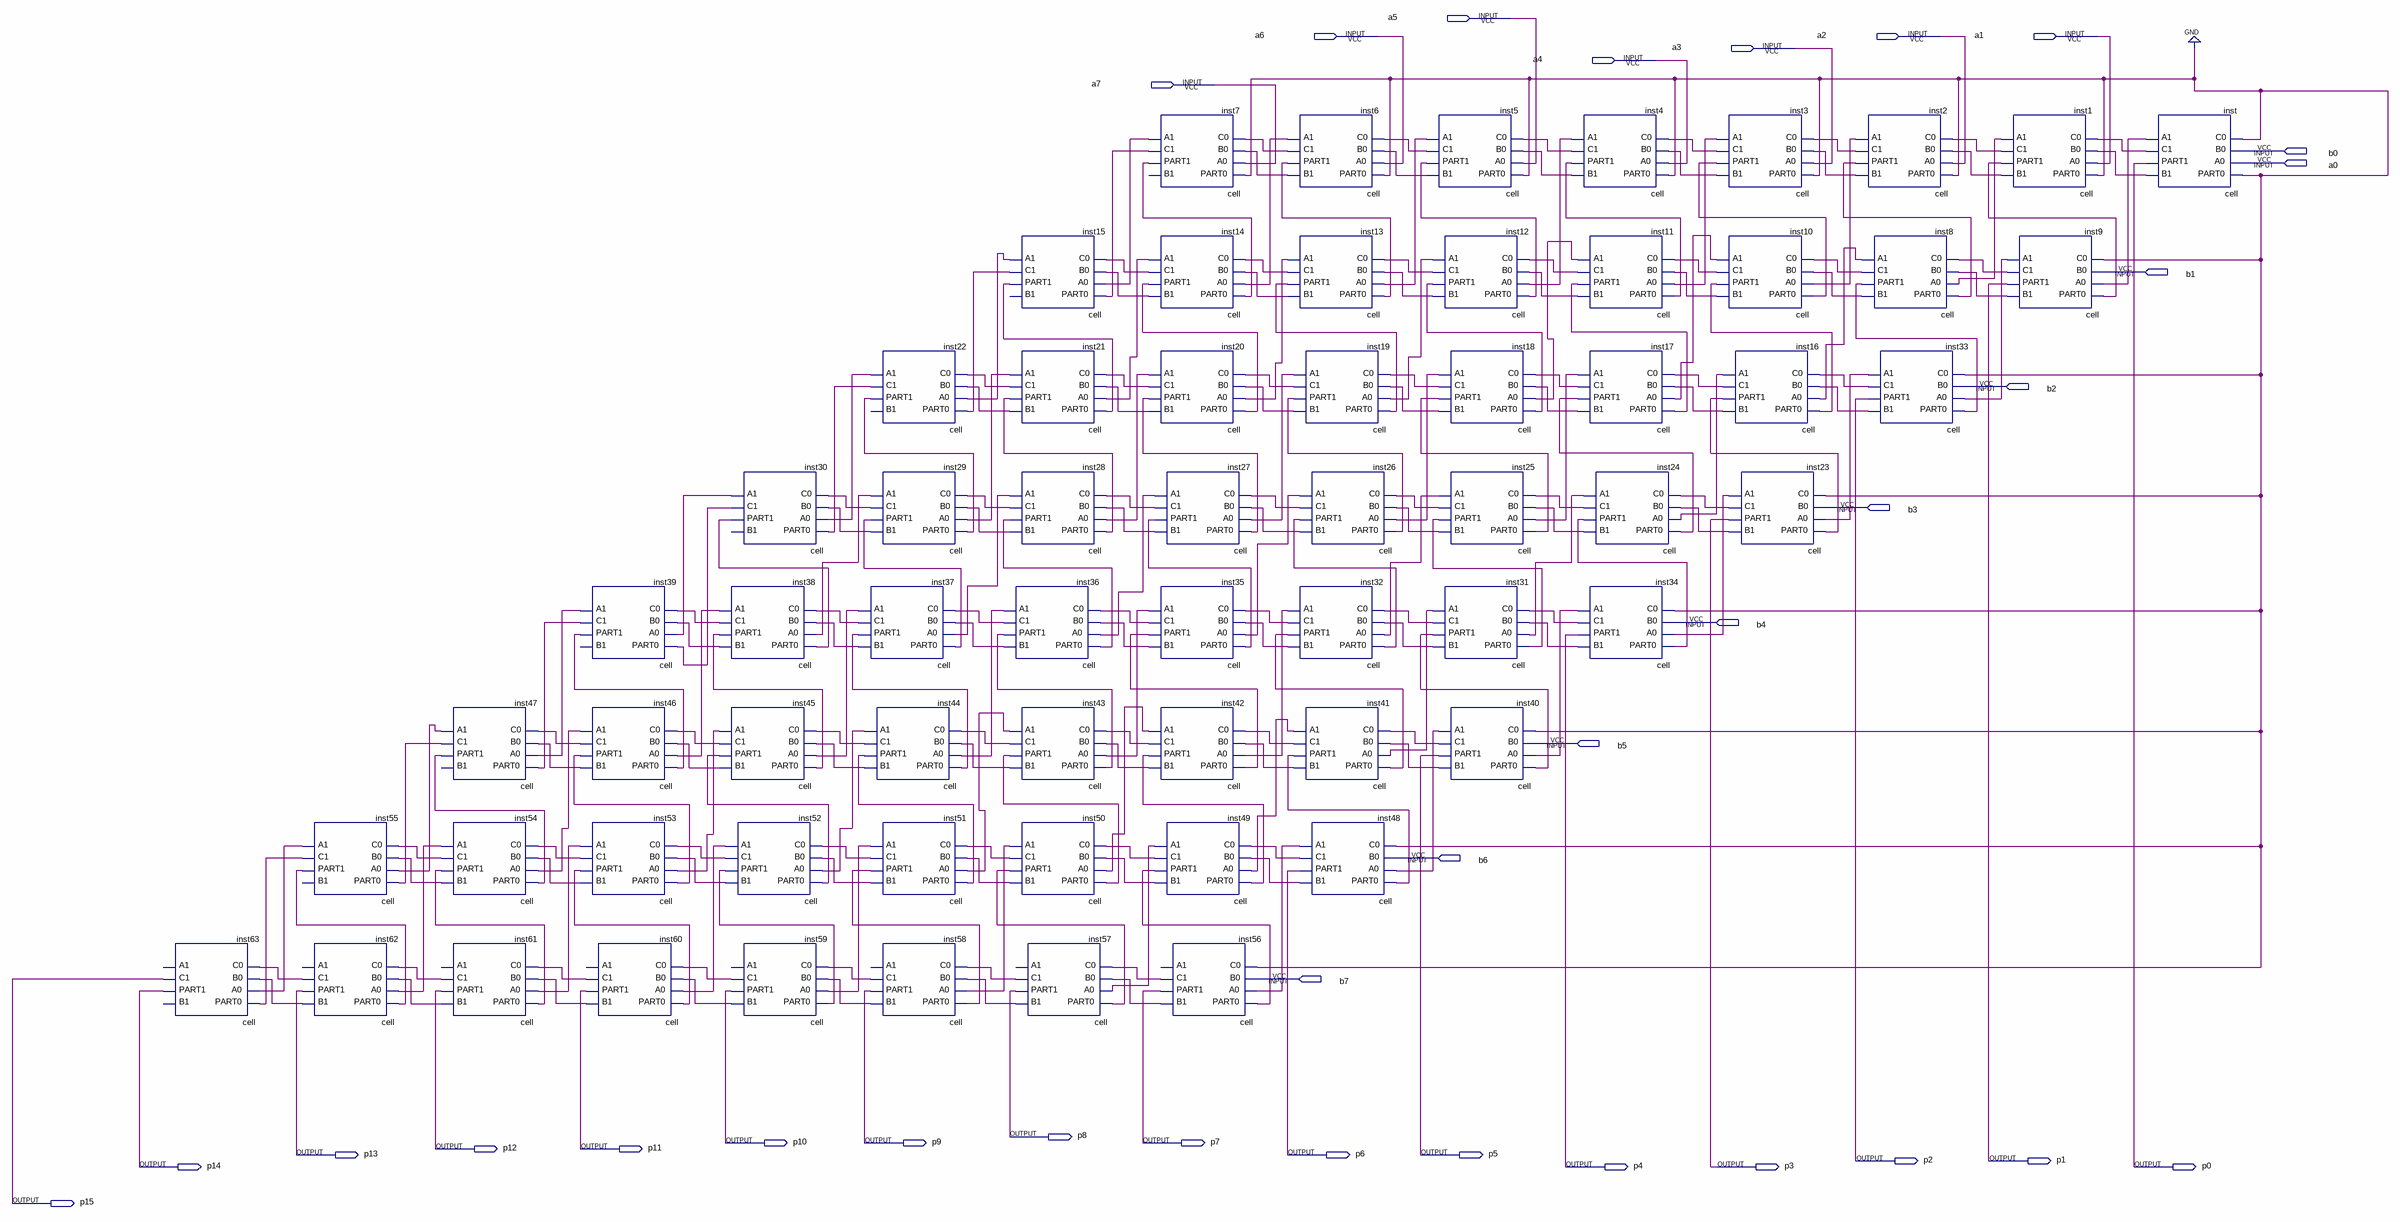
[diagram p0: schematic sheet]
// Quartus schematic METRIX.bdf as structural Verilog: 64 symbols, 32 pins
module METRIX (
  input  a5,
  input  a6,
  input  a2,
  input  a1,
  input  a3,
  input  a4,
  input  a7,
  input  b0,
  input  a0,
  input  b1,
  input  b2,
  input  b3,
  input  b4,
  input  b5,
  input  b6,
  input  b7,
  output p8,
  output p10,
  output p9,
  output p7,
  output p12,
  output p11,
  output p13,
  output p6,
  output p5,
  output p2,
  output p1,
  output p14,
  output p4,
  output p3,
  output p0,
  output p15
);

  wire inst1_a1, inst1_b1, inst1_c1, inst1_part1, inst2_a1, inst2_b1, inst2_c1, inst2_part1, inst3_a1,
       inst3_b1, inst3_c1, inst3_part1, inst4_a1, inst4_b1, inst4_c1, inst4_part1, inst5_a1, inst5_b1,
       inst5_c1, inst5_part1, inst6_a1, inst6_b1, inst6_c1, inst6_part1, inst7_a1, inst7_c1, inst7_part1,
       inst8_a1, inst8_b1, inst8_c1, inst8_part1, inst9_a1, inst9_b1, inst9_c1, inst10_a1, inst10_b1,
       inst10_c1, inst10_part1, inst11_a1, inst11_b1, inst11_c1, inst11_part1, inst12_a1, inst12_b1,
       inst12_c1, inst12_part1, inst13_a1, inst13_b1, inst13_c1, inst13_part1, inst14_a1, inst14_b1,
       inst14_c1, inst14_part1, inst15_a1, inst15_c1, inst15_part1, inst16_a1, inst16_b1, inst16_c1,
       inst16_part1, inst17_a1, inst17_b1, inst17_c1, inst17_part1, inst18_a1, inst18_b1, inst18_c1,
       inst18_part1, inst19_a1, inst19_b1, inst19_c1, inst19_part1, inst20_a1, inst20_b1, inst20_c1,
       inst20_part1, inst21_a1, inst21_b1, inst21_c1, inst21_part1, inst22_a1, inst22_c1, inst22_part1,
       inst23_a1, inst23_b1, inst23_c1, inst24_a1, inst24_b1, inst24_c1, inst24_part1, inst25_a1, inst25_b1,
       inst25_c1, inst25_part1, inst26_a1, inst26_b1, inst26_c1, inst26_part1, inst27_a1, inst27_b1,
       inst27_c1, inst27_part1, inst28_a1, inst28_b1, inst28_c1, inst28_part1, inst29_a1, inst29_b1,
       inst29_c1, inst29_part1, inst30_a1, inst30_c1, inst30_part1, inst31_a1, inst31_b1, inst31_c1,
       inst31_part1, inst32_a1, inst32_b1, inst32_c1, inst32_part1, inst33_a1, inst33_b1, inst33_c1,
       inst34_a1, inst34_b1, inst34_c1, inst35_a1, inst35_b1, inst35_c1, inst35_part1, inst36_a1, inst36_b1,
       inst36_c1, inst36_part1, inst37_a1, inst37_b1, inst37_c1, inst37_part1, inst38_a1, inst38_b1,
       inst38_c1, inst38_part1, inst39_a1, inst39_c1, inst39_part1, inst40_a1, inst40_b1, inst40_c1,
       inst41_a1, inst41_b1, inst41_c1, inst41_part1, inst42_a1, inst42_b1, inst42_c1, inst42_part1,
       inst43_a1, inst43_b1, inst43_c1, inst43_part1, inst44_a1, inst44_b1, inst44_c1, inst44_part1,
       inst45_a1, inst45_b1, inst45_c1, inst45_part1, inst46_a1, inst46_b1, inst46_c1, inst46_part1,
       inst47_a1, inst47_c1, inst47_part1, inst48_a1, inst48_b1, inst48_c1, inst49_a1, inst49_b1, inst49_c1,
       inst49_part1, inst50_a1, inst50_b1, inst50_c1, inst50_part1, inst51_a1, inst51_b1, inst51_c1,
       inst51_part1, inst52_a1, inst52_b1, inst52_c1, inst52_part1, inst53_a1, inst53_b1, inst53_c1,
       inst53_part1, inst54_a1, inst54_b1, inst54_c1, inst54_part1, inst55_a1, inst55_c1, inst55_part1,
       inst56_b1, inst56_c1, inst57_b1, inst57_c1, inst58_b1, inst58_c1, inst59_b1, inst59_c1, inst60_b1,
       inst60_c1, inst61_b1, inst61_c1, inst62_b1, inst62_c1, inst_a1, inst_b1, inst_c1;

  \cell  inst63 (
    .PART0(inst55_c1), .A0(inst55_a1), .B0(inst62_b1), .C0(inst62_c1), .PART1(p14), .C1(p15));  // open: B1, A1
  \cell  inst55 (
    .PART0(inst47_c1), .A0(inst47_a1), .B0(inst54_b1), .C0(inst54_c1), .PART1(inst55_part1), .C1(inst55_c1),
    .A1(inst55_a1));  // open: B1
  \cell  inst62 (
    .PART0(inst55_part1), .A0(inst54_a1), .B0(inst61_b1), .C0(inst61_c1), .B1(inst62_b1), .PART1(p13),
    .C1(inst62_c1));  // open: A1
  \cell  inst47 (
    .PART0(inst39_c1), .A0(inst39_a1), .B0(inst46_b1), .C0(inst46_c1), .PART1(inst47_part1), .C1(inst47_c1),
    .A1(inst47_a1));  // open: B1
  \cell  inst54 (
    .PART0(inst47_part1), .A0(inst46_a1), .B0(inst53_b1), .C0(inst53_c1), .B1(inst54_b1),
    .PART1(inst54_part1), .C1(inst54_c1), .A1(inst54_a1));
  \cell  inst61 (
    .PART0(inst54_part1), .A0(inst53_a1), .B0(inst60_b1), .C0(inst60_c1), .B1(inst61_b1), .PART1(p12),
    .C1(inst61_c1));  // open: A1
  \cell  inst39 (
    .PART0(inst30_c1), .A0(inst30_a1), .B0(inst38_b1), .C0(inst38_c1), .PART1(inst39_part1), .C1(inst39_c1),
    .A1(inst39_a1));  // open: B1
  \cell  inst46 (
    .PART0(inst39_part1), .A0(inst38_a1), .B0(inst45_b1), .C0(inst45_c1), .B1(inst46_b1),
    .PART1(inst46_part1), .C1(inst46_c1), .A1(inst46_a1));
  \cell  inst53 (
    .PART0(inst46_part1), .A0(inst45_a1), .B0(inst52_b1), .C0(inst52_c1), .B1(inst53_b1),
    .PART1(inst53_part1), .C1(inst53_c1), .A1(inst53_a1));
  \cell  inst60 (
    .PART0(inst53_part1), .A0(inst52_a1), .B0(inst59_b1), .C0(inst59_c1), .B1(inst60_b1), .PART1(p11),
    .C1(inst60_c1));  // open: A1
  \cell  inst30 (
    .PART0(inst22_c1), .A0(inst22_a1), .B0(inst29_b1), .C0(inst29_c1), .PART1(inst30_part1), .C1(inst30_c1),
    .A1(inst30_a1));  // open: B1
  \cell  inst38 (
    .PART0(inst30_part1), .A0(inst29_a1), .B0(inst37_b1), .C0(inst37_c1), .B1(inst38_b1),
    .PART1(inst38_part1), .C1(inst38_c1), .A1(inst38_a1));
  \cell  inst45 (
    .PART0(inst38_part1), .A0(inst37_a1), .B0(inst44_b1), .C0(inst44_c1), .B1(inst45_b1),
    .PART1(inst45_part1), .C1(inst45_c1), .A1(inst45_a1));
  \cell  inst52 (
    .PART0(inst45_part1), .A0(inst44_a1), .B0(inst51_b1), .C0(inst51_c1), .B1(inst52_b1),
    .PART1(inst52_part1), .C1(inst52_c1), .A1(inst52_a1));
  \cell  inst59 (
    .PART0(inst52_part1), .A0(inst51_a1), .B0(inst58_b1), .C0(inst58_c1), .B1(inst59_b1), .PART1(p10),
    .C1(inst59_c1));  // open: A1
  \cell  inst22 (
    .PART0(inst15_c1), .A0(inst15_a1), .B0(inst21_b1), .C0(inst21_c1), .PART1(inst22_part1), .C1(inst22_c1),
    .A1(inst22_a1));  // open: B1
  \cell  inst29 (
    .PART0(inst22_part1), .A0(inst21_a1), .B0(inst28_b1), .C0(inst28_c1), .B1(inst29_b1),
    .PART1(inst29_part1), .C1(inst29_c1), .A1(inst29_a1));
  \cell  inst37 (
    .PART0(inst29_part1), .A0(inst28_a1), .B0(inst36_b1), .C0(inst36_c1), .B1(inst37_b1),
    .PART1(inst37_part1), .C1(inst37_c1), .A1(inst37_a1));
  \cell  inst44 (
    .PART0(inst37_part1), .A0(inst36_a1), .B0(inst43_b1), .C0(inst43_c1), .B1(inst44_b1),
    .PART1(inst44_part1), .C1(inst44_c1), .A1(inst44_a1));
  \cell  inst51 (
    .PART0(inst44_part1), .A0(inst43_a1), .B0(inst50_b1), .C0(inst50_c1), .B1(inst51_b1),
    .PART1(inst51_part1), .C1(inst51_c1), .A1(inst51_a1));
  \cell  inst58 (
    .PART0(inst51_part1), .A0(inst50_a1), .B0(inst57_b1), .C0(inst57_c1), .B1(inst58_b1), .PART1(p9),
    .C1(inst58_c1));  // open: A1
  \cell  inst15 (
    .PART0(inst7_c1), .A0(inst7_a1), .B0(inst14_b1), .C0(inst14_c1), .PART1(inst15_part1), .C1(inst15_c1),
    .A1(inst15_a1));  // open: B1
  \cell  inst21 (
    .PART0(inst15_part1), .A0(inst14_a1), .B0(inst20_b1), .C0(inst20_c1), .B1(inst21_b1),
    .PART1(inst21_part1), .C1(inst21_c1), .A1(inst21_a1));
  \cell  inst28 (
    .PART0(inst21_part1), .A0(inst20_a1), .B0(inst27_b1), .C0(inst27_c1), .B1(inst28_b1),
    .PART1(inst28_part1), .C1(inst28_c1), .A1(inst28_a1));
  \cell  inst36 (
    .PART0(inst28_part1), .A0(inst27_a1), .B0(inst35_b1), .C0(inst35_c1), .B1(inst36_b1),
    .PART1(inst36_part1), .C1(inst36_c1), .A1(inst36_a1));
  \cell  inst43 (
    .PART0(inst36_part1), .A0(inst35_a1), .B0(inst42_b1), .C0(inst42_c1), .B1(inst43_b1),
    .PART1(inst43_part1), .C1(inst43_c1), .A1(inst43_a1));
  \cell  inst50 (
    .PART0(inst43_part1), .A0(inst42_a1), .B0(inst49_b1), .C0(inst49_c1), .B1(inst50_b1),
    .PART1(inst50_part1), .C1(inst50_c1), .A1(inst50_a1));
  \cell  inst57 (
    .PART0(inst50_part1), .A0(inst49_a1), .B0(inst56_b1), .C0(inst56_c1), .B1(inst57_b1), .PART1(p8),
    .C1(inst57_c1));  // open: A1
  \cell  inst7 (
    .PART0(1'b0), .A0(a7), .B0(inst6_b1), .C0(inst6_c1), .PART1(inst7_part1), .C1(inst7_c1), .A1(inst7_a1));  // open: B1
  \cell  inst14 (
    .PART0(inst7_part1), .A0(inst6_a1), .B0(inst13_b1), .C0(inst13_c1), .B1(inst14_b1), .PART1(inst14_part1),
    .C1(inst14_c1), .A1(inst14_a1));
  \cell  inst20 (
    .PART0(inst14_part1), .A0(inst13_a1), .B0(inst19_b1), .C0(inst19_c1), .B1(inst20_b1),
    .PART1(inst20_part1), .C1(inst20_c1), .A1(inst20_a1));
  \cell  inst27 (
    .PART0(inst20_part1), .A0(inst19_a1), .B0(inst26_b1), .C0(inst26_c1), .B1(inst27_b1),
    .PART1(inst27_part1), .C1(inst27_c1), .A1(inst27_a1));
  \cell  inst35 (
    .PART0(inst27_part1), .A0(inst26_a1), .B0(inst32_b1), .C0(inst32_c1), .B1(inst35_b1),
    .PART1(inst35_part1), .C1(inst35_c1), .A1(inst35_a1));
  \cell  inst42 (
    .PART0(inst35_part1), .A0(inst32_a1), .B0(inst41_b1), .C0(inst41_c1), .B1(inst42_b1),
    .PART1(inst42_part1), .C1(inst42_c1), .A1(inst42_a1));
  \cell  inst49 (
    .PART0(inst42_part1), .A0(inst41_a1), .B0(inst48_b1), .C0(inst48_c1), .B1(inst49_b1),
    .PART1(inst49_part1), .C1(inst49_c1), .A1(inst49_a1));
  \cell  inst56 (
    .PART0(inst49_part1), .A0(inst48_a1), .B0(b7), .C0(1'b0), .B1(inst56_b1), .PART1(p7), .C1(inst56_c1));  // open: A1
  \cell  inst6 (
    .PART0(1'b0), .A0(a6), .B0(inst5_b1), .C0(inst5_c1), .B1(inst6_b1), .PART1(inst6_part1), .C1(inst6_c1),
    .A1(inst6_a1));
  \cell  inst13 (
    .PART0(inst6_part1), .A0(inst5_a1), .B0(inst12_b1), .C0(inst12_c1), .B1(inst13_b1), .PART1(inst13_part1),
    .C1(inst13_c1), .A1(inst13_a1));
  \cell  inst19 (
    .PART0(inst13_part1), .A0(inst12_a1), .B0(inst18_b1), .C0(inst18_c1), .B1(inst19_b1),
    .PART1(inst19_part1), .C1(inst19_c1), .A1(inst19_a1));
  \cell  inst26 (
    .PART0(inst19_part1), .A0(inst18_a1), .B0(inst25_b1), .C0(inst25_c1), .B1(inst26_b1),
    .PART1(inst26_part1), .C1(inst26_c1), .A1(inst26_a1));
  \cell  inst32 (
    .PART0(inst26_part1), .A0(inst25_a1), .B0(inst31_b1), .C0(inst31_c1), .B1(inst32_b1),
    .PART1(inst32_part1), .C1(inst32_c1), .A1(inst32_a1));
  \cell  inst41 (
    .PART0(inst32_part1), .A0(inst31_a1), .B0(inst40_b1), .C0(inst40_c1), .B1(inst41_b1),
    .PART1(inst41_part1), .C1(inst41_c1), .A1(inst41_a1));
  \cell  inst48 (
    .PART0(inst41_part1), .A0(inst40_a1), .B0(b6), .C0(1'b0), .B1(inst48_b1), .PART1(p6), .C1(inst48_c1),
    .A1(inst48_a1));
  \cell  inst5 (
    .PART0(1'b0), .A0(a5), .B0(inst4_b1), .C0(inst4_c1), .B1(inst5_b1), .PART1(inst5_part1), .C1(inst5_c1),
    .A1(inst5_a1));
  \cell  inst12 (
    .PART0(inst5_part1), .A0(inst4_a1), .B0(inst11_b1), .C0(inst11_c1), .B1(inst12_b1), .PART1(inst12_part1),
    .C1(inst12_c1), .A1(inst12_a1));
  \cell  inst18 (
    .PART0(inst12_part1), .A0(inst11_a1), .B0(inst17_b1), .C0(inst17_c1), .B1(inst18_b1),
    .PART1(inst18_part1), .C1(inst18_c1), .A1(inst18_a1));
  \cell  inst25 (
    .PART0(inst18_part1), .A0(inst17_a1), .B0(inst24_b1), .C0(inst24_c1), .B1(inst25_b1),
    .PART1(inst25_part1), .C1(inst25_c1), .A1(inst25_a1));
  \cell  inst31 (
    .PART0(inst25_part1), .A0(inst24_a1), .B0(inst34_b1), .C0(inst34_c1), .B1(inst31_b1),
    .PART1(inst31_part1), .C1(inst31_c1), .A1(inst31_a1));
  \cell  inst40 (
    .PART0(inst31_part1), .A0(inst34_a1), .B0(b5), .C0(1'b0), .B1(inst40_b1), .PART1(p5), .C1(inst40_c1),
    .A1(inst40_a1));
  \cell  inst4 (
    .PART0(1'b0), .A0(a4), .B0(inst3_b1), .C0(inst3_c1), .B1(inst4_b1), .PART1(inst4_part1), .C1(inst4_c1),
    .A1(inst4_a1));
  \cell  inst11 (
    .PART0(inst4_part1), .A0(inst3_a1), .B0(inst10_b1), .C0(inst10_c1), .B1(inst11_b1), .PART1(inst11_part1),
    .C1(inst11_c1), .A1(inst11_a1));
  \cell  inst17 (
    .PART0(inst11_part1), .A0(inst10_a1), .B0(inst16_b1), .C0(inst16_c1), .B1(inst17_b1),
    .PART1(inst17_part1), .C1(inst17_c1), .A1(inst17_a1));
  \cell  inst24 (
    .PART0(inst17_part1), .A0(inst16_a1), .B0(inst23_b1), .C0(inst23_c1), .B1(inst24_b1),
    .PART1(inst24_part1), .C1(inst24_c1), .A1(inst24_a1));
  \cell  inst34 (
    .PART0(inst24_part1), .A0(inst23_a1), .B0(b4), .C0(1'b0), .B1(inst34_b1), .PART1(p4), .C1(inst34_c1),
    .A1(inst34_a1));
  \cell  inst3 (
    .PART0(1'b0), .A0(a3), .B0(inst2_b1), .C0(inst2_c1), .B1(inst3_b1), .PART1(inst3_part1), .C1(inst3_c1),
    .A1(inst3_a1));
  \cell  inst10 (
    .PART0(inst3_part1), .A0(inst2_a1), .B0(inst8_b1), .C0(inst8_c1), .B1(inst10_b1), .PART1(inst10_part1),
    .C1(inst10_c1), .A1(inst10_a1));
  \cell  inst16 (
    .PART0(inst10_part1), .A0(inst8_a1), .B0(inst33_b1), .C0(inst33_c1), .B1(inst16_b1),
    .PART1(inst16_part1), .C1(inst16_c1), .A1(inst16_a1));
  \cell  inst23 (
    .PART0(inst16_part1), .A0(inst33_a1), .B0(b3), .C0(1'b0), .B1(inst23_b1), .PART1(p3), .C1(inst23_c1),
    .A1(inst23_a1));
  \cell  inst2 (
    .PART0(1'b0), .A0(a2), .B0(inst1_b1), .C0(inst1_c1), .B1(inst2_b1), .PART1(inst2_part1), .C1(inst2_c1),
    .A1(inst2_a1));
  \cell  inst8 (
    .PART0(inst2_part1), .A0(inst1_a1), .B0(inst9_b1), .C0(inst9_c1), .B1(inst8_b1), .PART1(inst8_part1),
    .C1(inst8_c1), .A1(inst8_a1));
  \cell  inst33 (
    .PART0(inst8_part1), .A0(inst9_a1), .B0(b2), .C0(1'b0), .B1(inst33_b1), .PART1(p2), .C1(inst33_c1),
    .A1(inst33_a1));
  \cell  inst1 (
    .PART0(1'b0), .A0(a1), .B0(inst_b1), .C0(inst_c1), .B1(inst1_b1), .PART1(inst1_part1), .C1(inst1_c1),
    .A1(inst1_a1));
  \cell  inst9 (
    .PART0(inst1_part1), .A0(inst_a1), .B0(b1), .C0(1'b0), .B1(inst9_b1), .PART1(p1), .C1(inst9_c1),
    .A1(inst9_a1));
  \cell  inst (.PART0(1'b0), .A0(a0), .B0(b0), .C0(1'b0), .B1(inst_b1), .PART1(p0), .C1(inst_c1), .A1(inst_a1));
endmodule
